# Altium schematic sheet I2C Peripherals.SCHDOC
size A4; Revision: C.2
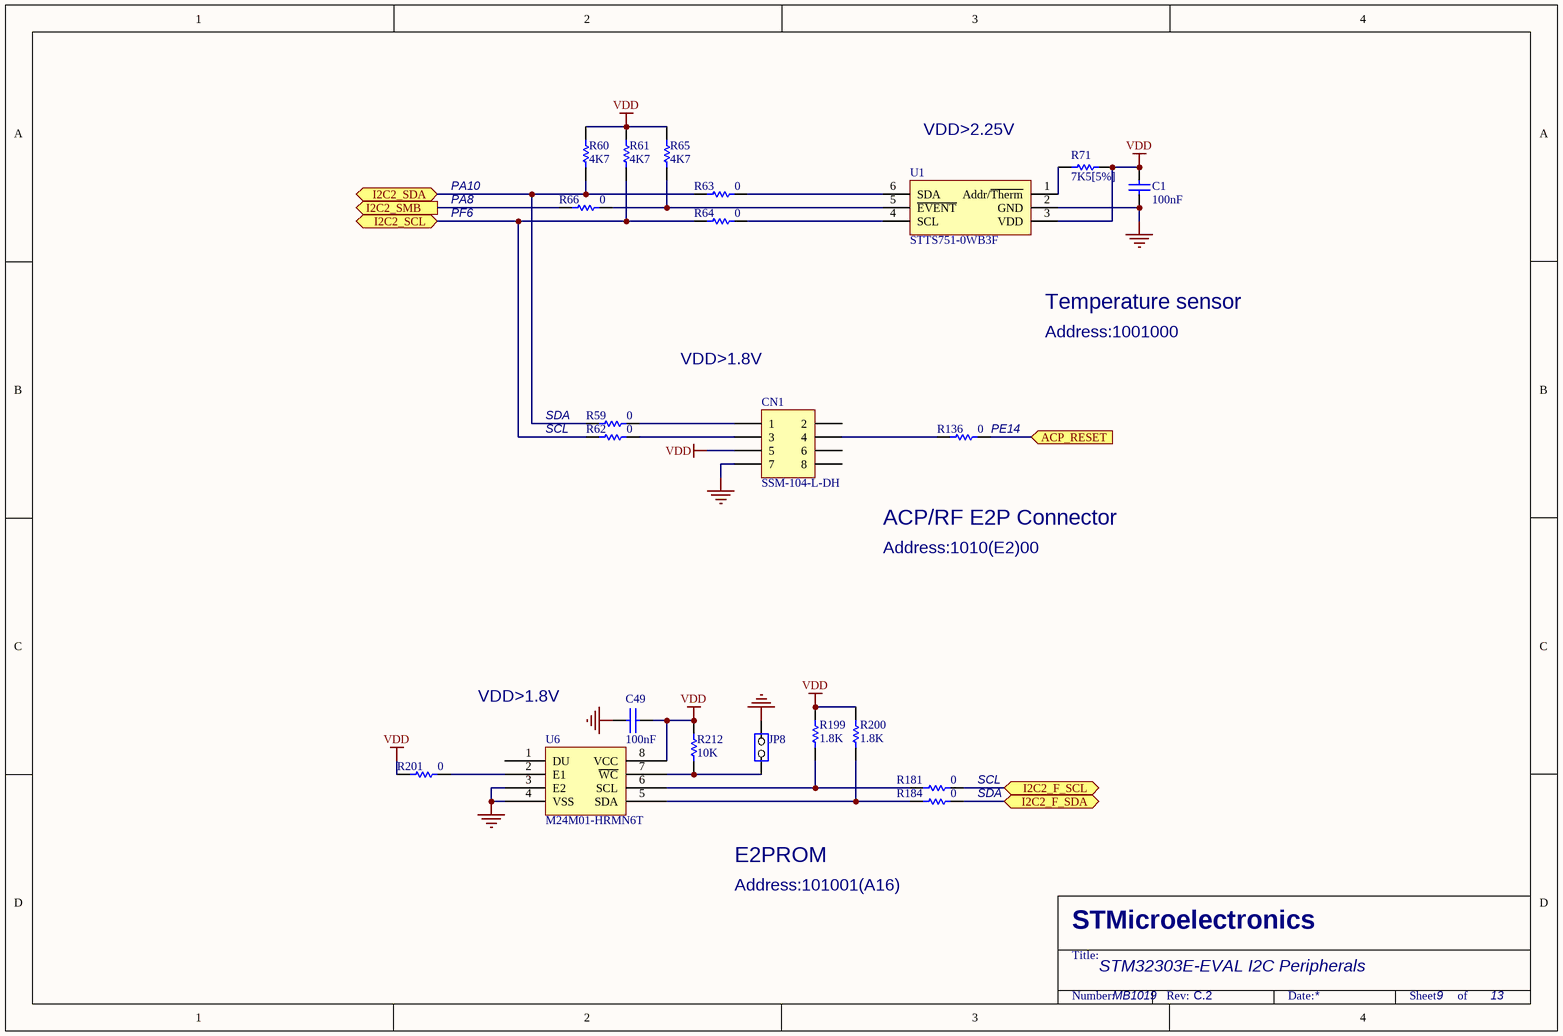
[diagram p0: I2C Peripherals.SCHDOC]

## Parts
C1  100nF  [0603C]
C49  100nF  [0603C]
CN1  SSM-104-L-DH  [SSM-104-L-DH]
JP8  (no value)  [SIP2]
R59  0  [0603R]
R60  4K7  [0603R]
R61  4K7  [0603R]
R62  0  [0603R]
R63  0  [0603R]
R64  0  [0603R]
R65  4K7  [0603R]
R66  0  [0603R]
R71  7K5[5%]  [0603R]
R136  0  [0603R]
R181  0  [0603R]
R184  0  [0603R]
R199  1.8K  [0603R]
R200  1.8K  [0603R]
R201  0  [0603R]
R212  10K  [0603R]
U1  STTS751-0WB3F  [SOT23-6L]
U6  M24M01-HRMN6T  [SO8]

## Ports
ACP_RESET (in), I2C2_F_SCL (bidir), I2C2_F_SDA (bidir), I2C2_SCL (bidir), I2C2_SDA (bidir), I2C2_SMB (out)

## Nets
GND: C1.1 C49.1 CN1.7 JP8.2(NO) U1.2(GND) U6.3(E2) U6.4(VSS)
VDD: C1.2 C49.2 CN1.5 R60.2 R61.2 R65.2 R71.1 R199.2 R200.2 R201.1 R212.1 U1.3(VDD) U6.8(VCC)
ACP_RESET: R136.1 ; port ACP_RESET
I2C2_F_SCL: R181.2 ; port I2C2_F_SCL
I2C2_F_SDA: R184.2 ; port I2C2_F_SDA
I2C2_SCL: R61.1 R62.1 R64.1 ; port I2C2_SCL
I2C2_SDA: R59.1 R60.1 R63.1 ; port I2C2_SDA
I2C2_SMB: R66.2 ; port I2C2_SMB
NetCN1_1: CN1.1 R59.2
NetCN1_3: CN1.3 R62.2
NetCN1_4: CN1.4 R136.2
NetJP8_1: JP8.1(COMMON) R212.2 U6.7(~{WC})
NetR63_2: R63.2 U1.6(SDA)
NetR64_2: R64.2 U1.4(SCL)
NetR65_1: R65.1 R66.1 U1.5(~{EVENT})
NetR71_2: R71.2 U1.1(Addr/~{Therm})
NetR181_1: R181.1 R199.1 U6.6(SCL)
NetR184_1: R184.1 R200.1 U6.5(SDA)
NetR201_2: R201.2 U6.2(E1)

Not connected (* = marked no-connect by the designer): CN1 2 6 8; U6 1(DU)

## Notes on the sheet
- VDD>2.25V
- PA10
- PA8
- PF6
- Temperature sensor
- VDD>1.8V
- Address:1001000
- SDA
- SCL
- (near R136) PE14
- Address:1010(E2)00
- ACP/RF E2P Connector
- Address:101001(A16)
- E2PROM
- STM32303E-EVAL I2C Peripherals
- MB1019
- 9
- 13
- STMicroelectronics
- Title:
- Number:
- Rev:
- Date:
- Sheet       of

## Library data of the parts
C1 = cap: Capacitor; Value: 100pF; Published: 8-Jun-2000; Revision: July-2002: Re-released for DXP Platform.; Publisher: Altium Limited
C49 = CAP: Capacitor
CN1 = SSM-104-L-DH: Header, 5-Pin, Dual row; Revision: 17-Jul-2002: Re-released for DXP Platform.; Publisher: Altium Limited
JP8 = JP2
R59-R66 R71 R136 R181 R184 R199-R201 = Res1: Resistor; Value: 1K; Published: 8-Jun-2000; Revision: July-2002: Re-released for DXP Platform.; Publisher: Altium Limited
R212 = res1: Resistor; Value: 1K; Published: 8-Jun-2000; Revision: July-2002: Re-released for DXP Platform.; Publisher: Altium Limited
U6 = M24M01